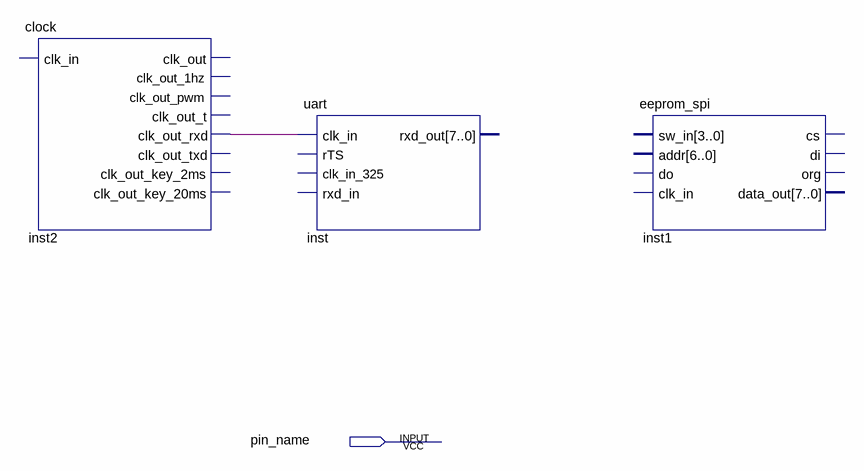
[diagram p0: schematic sheet]
// Quartus schematic eee.bdf as structural Verilog: 3 symbols, 1 pins
module eee (
  input  pin_name
);

  wire inst2_clk_out_rxd;

  clock inst2 (.clk_out_rxd(inst2_clk_out_rxd));  // open: clk_in, clk_out, clk_out_1hz, clk_out_pwm, clk_out_t, clk_out_txd, clk_out_key_2ms, clk_out_key_20ms
  uart inst (.clk_in(inst2_clk_out_rxd));  // open: rTS, clk_in_325, rxd_in, rxd_out
  eeprom_spi inst1 ();  // open: sw_in, addr, do, clk_in, cs, di, org, data_out
endmodule
